# EAGLE schematic BNC Shield 0.1-0.8 SMD (EAGLE 6.3)
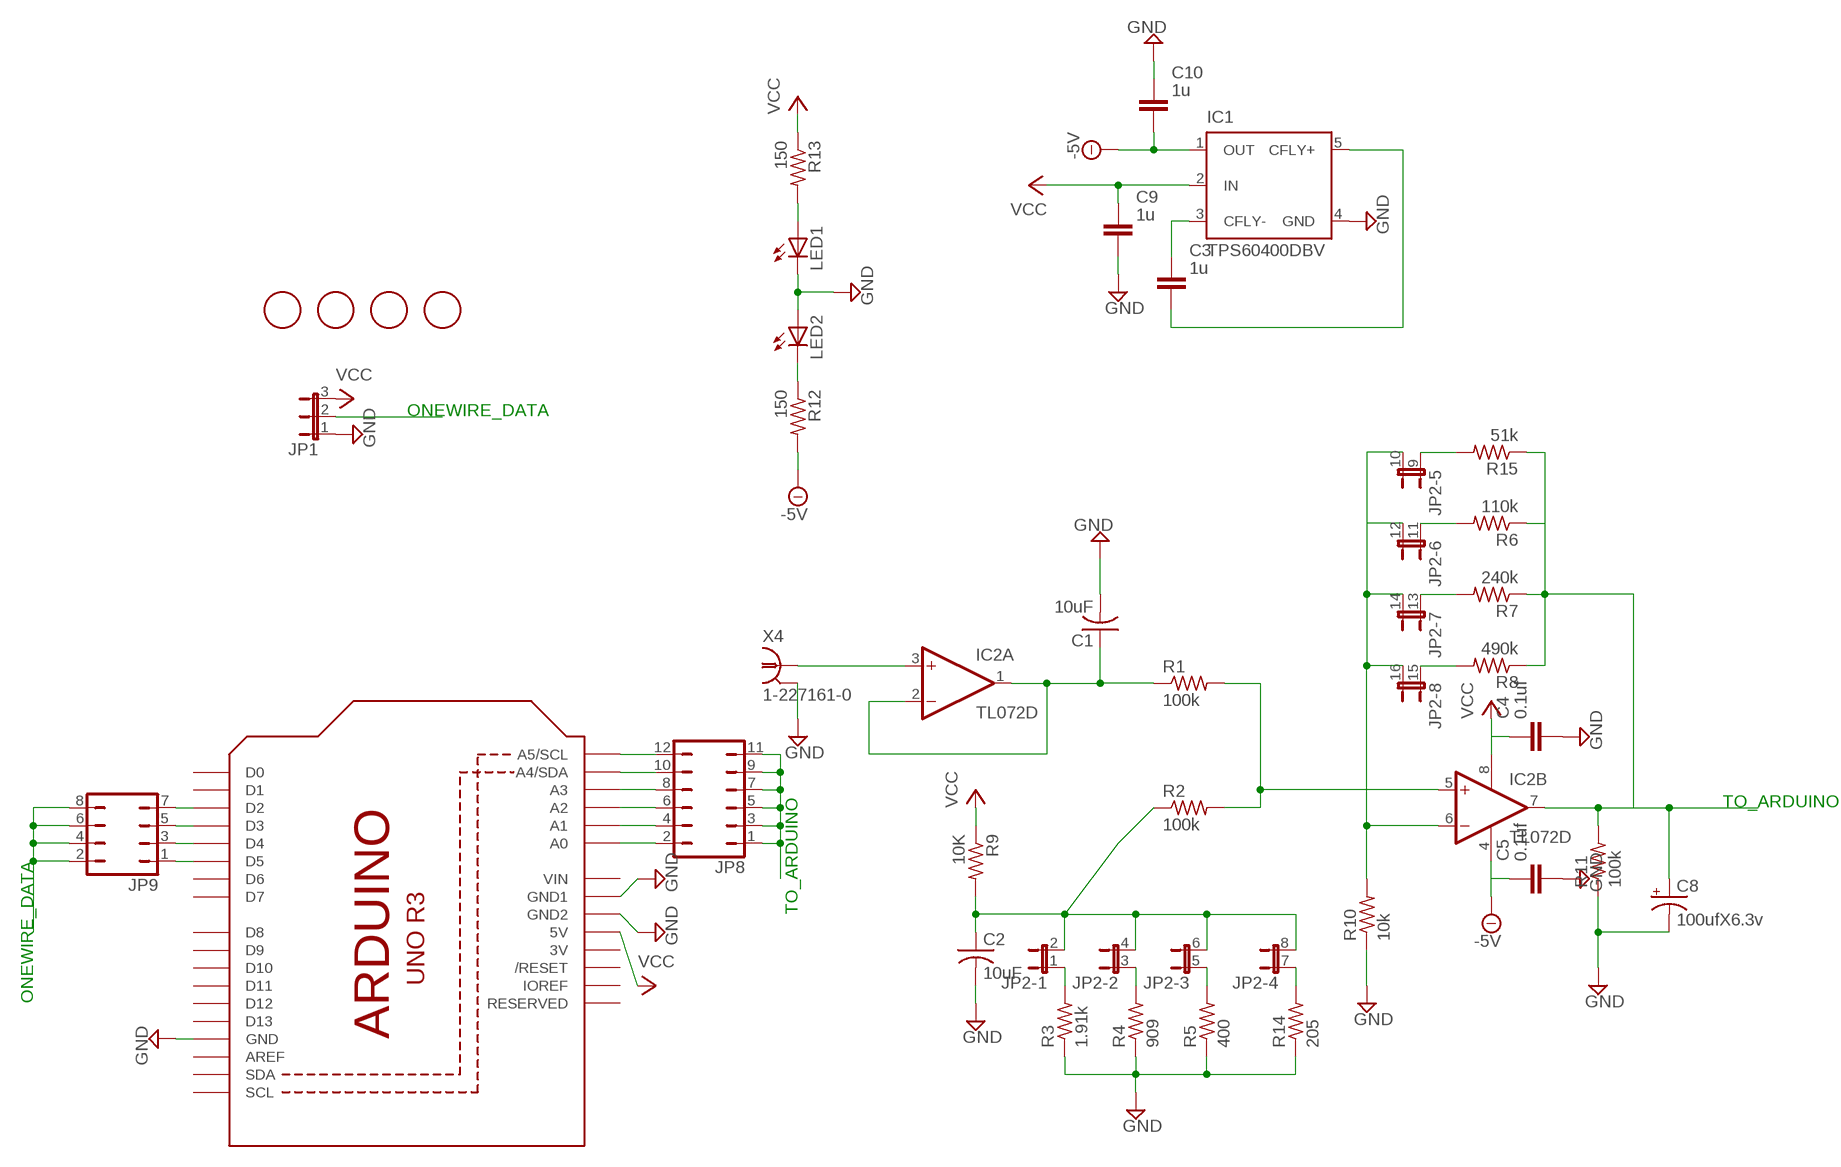
[diagram p0: schematic, sheet 1]

## Parts
C1  10uF  C-USC0603  [C0603]
C2  10uF  C-USC0603  [C0603]
C3  1u  CAPACITOR_NPOL-0603  [C603]
C4  0.1uf  CAPACITOR_NPOL-0603  [C603]
C5  0.1uf  CAPACITOR_NPOL-0603  [C603]
C8  100ufX6.3v  CPOL-US153CLV-0605  [153CLV-0605]
C9  1u  CAPACITOR_NPOL-0603  [C603]
C10  1u  CAPACITOR_NPOL-0603  [C603]
IC1  TPS60400DBV  [SOT23-DBV]
IC2  TL072D  [SO08]
JP1  JP2E  [JP2]
JP2  JP8QE  [JP8Q]
JP8  JP6Q  [JP6Q]
JP9  JP4Q  [JP4Q]
LED1  LEDCHIP-LED0603  [CHIP-LED0603]
LED2  LEDCHIP-LED0603  [CHIP-LED0603]
R1  100k  R-US_R0603  [R0603]
R2  100k  R-US_R0603  [R0603]
R3  1.91k  R-US_R0603  [R0603]
R4  909  R-US_R0603  [R0603]
R5  400  R-US_R0603  [R0603]
R6  110k  R-US_R0603  [R0603]
R7  240k  R-US_R0603  [R0603]
R8  490k  R-US_R0603  [R0603]
R9  10K  R-US_R0603  [R0603]
R10  10k  R-US_R0603  [R0603]
R11  100k  R-US_R0603  [R0603]
R12  150  R-US_R0603  [R0603]
R13  150  R-US_R0603  [R0603]
R14  205  R-US_R0603  [R0603]
R15  51k  R-US_R0603  [R0603]
U1  ARDUINOR3-DIMENSION  [ARDUINOR3]
U$2  FIDUCIAL  [FIDUCIAL_1MM]
U$3  FIDUCIAL  [FIDUCIAL_1MM]
U$4  FIDUCIAL  [FIDUCIAL_1MM]
U$5  FIDUCIAL  [FIDUCIAL_1MM]
X4  1-227161-0  [AMP_227161]

## Nets
-5V: C5.1 C10.2 IC1.1(OUT) IC2.4(P:V-) R12.2
GND: C1.2 C2.2 C4.2 C5.2 C8.- C9.2 C10.1 IC1.4(GND) JP1.1 LED1.C LED2.A R3.1 R4.1 R5.1 R10.1 R11.1 R14.1 U1.GND U1.GND1 U1.GND2 X4.2(GND)
N$1: C1.1 IC2.1(A:OUT) IC2.2(A:-IN) R1.1
N$2: JP2.1 R3.2
N$3: JP2.3 R4.2
N$4: JP2.5 R5.2
N$5: IC2.5(B:+IN) R1.2 R2.2
N$6: C2.1 JP2.2 JP2.4 JP2.6 JP2.8 R2.1 R9.2
N$7: JP2.11 R6.2
N$8: JP2.13 R7.2
N$9: JP2.15 R8.2
N$10: JP9.1 U1.D5
N$11: IC2.6(B:-IN) JP2.10 JP2.12 JP2.14 JP2.16 R10.2
N$12: IC2.3(A:+IN) X4.1
N$13: JP8.2 U1.A0
N$14: JP8.4 U1.A1
N$15: JP8.6 U1.A2
N$16: JP8.8 U1.A3
N$17: JP9.3 U1.D4
N$18: LED2.C R12.1
N$19: LED1.A R13.2
N$21: JP8.10 U1.A4(A4/SDA)
N$22: C3.1 IC1.3(CFLY-)
N$23: C3.2 IC1.5(CFLY+)
N$24: JP9.5 U1.D3
N$25: JP9.7 U1.D2
N$26: JP8.12 U1.A5(A5/SCL)
N$27: JP2.7 R14.2
N$28: JP2.9 R15.2
ONEWIRE_DATA: JP1.2 JP9.2 JP9.4 JP9.6 JP9.8
TO_ARDUINO: C8.+ IC2.7(B:OUT) JP8.1 JP8.3 JP8.5 JP8.7 JP8.9 JP8.11 R6.1 R7.1 R8.1 R11.2 R15.1
VCC: C4.1 C9.1 IC1.2(IN) IC2.8(P:V+) JP1.3 R9.1 R13.1 U1.5V
Unconnected: U1.AREF U1.D0 U1.D1 U1.D6 U1.D7 U1.D8 U1.D9 U1.D10 U1.D11 U1.D12 U1.D13 U1.IOREF U1.RESERVED U1.RESET(/RESET) U1.SCL U1.SDA

## Notes on the sheet
- ONEWIRE_DATA
- TO_ARDUINO
- TO_ARDUINO
- ONEWIRE_DATA

## Power pins joined to a net without a drawn wire
3V: U1.3V
VIN: U1.VIN

## Library data of the parts
C1 C2 = resistor:C-US: CAPACITOR, American symbol
C3-C5 C9 C10 = dp_devices:CAPACITOR_NPOL: Non-Polarized capacitor in various packages
C8 = adafruit:CPOL-US: POLARIZED CAPACITOR, American symbol
IC1 = SparkysWidgets:TPS60400DBV: UNREGULATED CHARGE PUMP VOLTAGE INVERTER 60-mA unregultated charge pump voltage inverter Source: http://focus.ti.com/lit/ds/symlink/tps6040i.pdf
IC2 = linear:TL072: OP AMP
JP1 = jumper:JP2E: JUMPER
JP2 = jumper:JP8QE: JUMPER
JP8 = jumper:JP6Q: JUMPER
JP9 = jumper:JP4Q: JUMPER
LED1 LED2 = adafruit:LED: LED OSRAM: - CHIPLED LG R971, LG N971, LY N971, LG Q971, LY Q971, LO R971, LY R971 LH N974, LH R974 LS Q976, LO Q976, LY Q976 LO Q996 - Hyper CHIPLED LW Q18S LB Q993, LB Q99A, LB R99A - SideLED LS A670, LO A670, LY A670, LG A670, LP A670 LB A673, LV A673, LT A673, LW A673 LH A674 LY A675 LS A676, LA A676, LO A676, LY A676, LW A676 LS A679, LY A679, LG A679 - Hyper Micro SIDELED® LS Y876, LA Y876, LO Y876, LY Y876 LT Y87S - SmartLED LW L88C, LW L88S LB L89C, LB L89S, LG L890 LS L89K, LO L89K, LY L89K LS L896, LA L896, LO L896, LY L896 - TOPLED LS T670, LO T670, LY T670, LG T670, LP T670 LSG T670, LSP T670, LSY T670, LOP T670, LYG T670 LG T671, LOG T671, LSG T671 LB T673, LV T673, LT T673, LW T673 LH T674 LS T676, LA T676, LO T676, LY T676, LB T676, LH T676, LSB T676, LW T676 LB T67C, LV T67C, LT T67C, LS T67K, LO T67K, LY T67K, LW E67C LS E67B, LA E67B, LO E67B, LY E67B, LB E67C, LV E67C, LT E67C LW T67C LS T679, LY T679, LG T679 LS T770, LO T770, LY T770, LG T770, LP T770 LB T773, LV T773, LT T773, LW T773 LH T774 LS E675, LA E675, LY E675, LS T675 LS T776, LA T776, LO T776, LY T776, LB T776 LHGB T686 LT T68C, LB T68C - Hyper Mini TOPLED® LB M676 - Mini TOPLED Santana® LG M470 LS M47K, LO M47K, LY M47K Source: http://www.osram.convergy.de/
R1-R15 = resistor:R-US_: RESISTOR, American symbol
U1 = adafruit:ARDUINOR3: This is a new object for the new Arduino R3 - with extra pins that you may want to use (such as IOref, and duplicated A4/A5
U$2-U$5 = adafruit:FIDUCIAL: For use by pick and place machines to calibrate the vision/machine, 1mm By microbuilder.eu
X4 = con-coax:?227161*: JACK, RIGHT ANGLE, 50 OHM, PCB, BNC Source: amp_227161.pdf